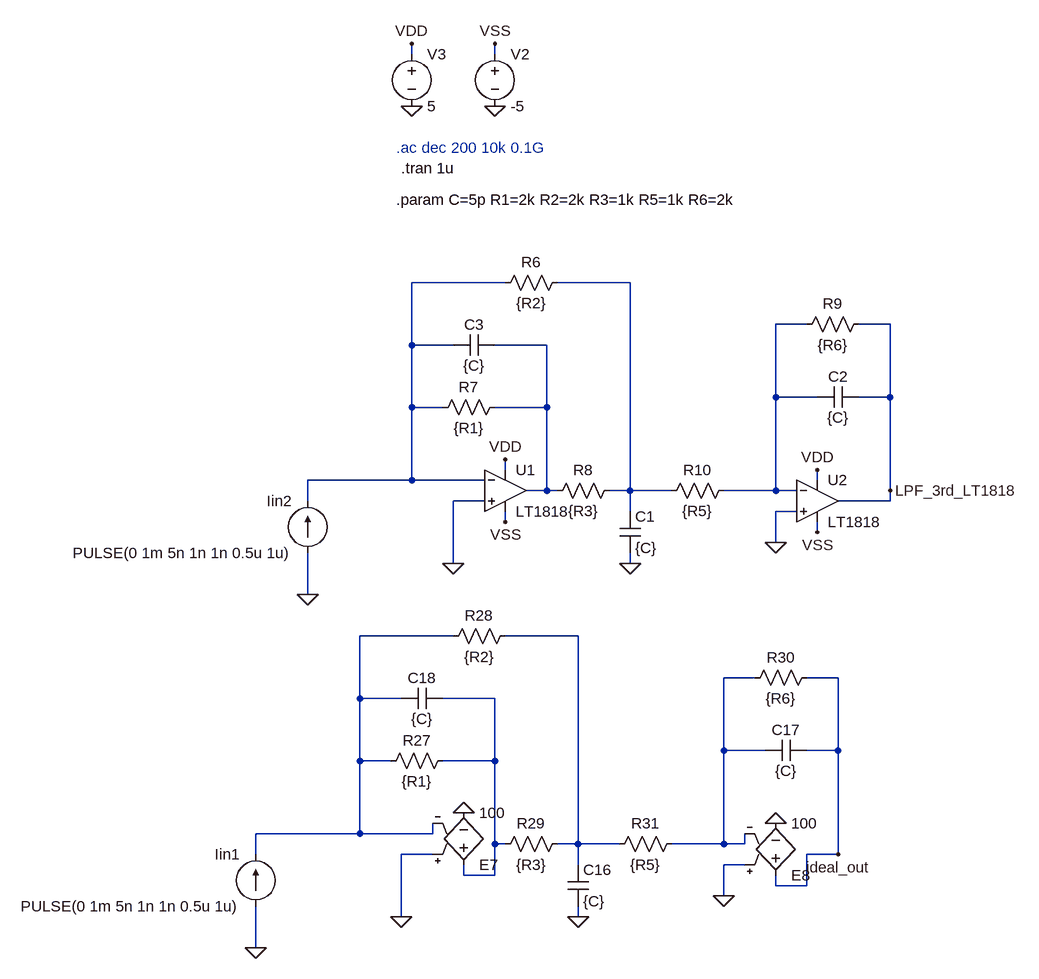
[diagram p0: schematic TIA-ALL_Z-LPF-TimeSim.asc]
TIA-ALL_Z-LPF-TimeSim.asc, the LTspice schematic file:
Version 4
SHEET 1 3536 3016
WIRE 496 608 496 592
WIRE 624 608 624 592
WIRE 640 960 496 960
WIRE 832 960 720 960
WIRE 1104 1024 1056 1024
WIRE 1232 1024 1184 1024
WIRE 496 1056 496 960
WIRE 560 1056 496 1056
WIRE 704 1056 624 1056
WIRE 1056 1136 1056 1024
WIRE 1120 1136 1056 1136
WIRE 1232 1136 1232 1024
WIRE 1232 1136 1184 1136
WIRE 496 1152 496 1056
WIRE 544 1152 496 1152
WIRE 704 1152 704 1056
WIRE 704 1152 624 1152
WIRE 640 1248 640 1232
WIRE 496 1264 496 1152
WIRE 496 1264 336 1264
WIRE 608 1264 496 1264
WIRE 1120 1264 1120 1248
WIRE 704 1280 704 1152
WIRE 704 1280 672 1280
WIRE 720 1280 704 1280
WIRE 832 1280 832 960
WIRE 832 1280 800 1280
WIRE 896 1280 832 1280
WIRE 1056 1280 1056 1136
WIRE 1056 1280 976 1280
WIRE 1088 1280 1056 1280
WIRE 1232 1280 1232 1136
WIRE 336 1296 336 1264
WIRE 608 1296 560 1296
WIRE 1232 1296 1232 1280
WIRE 1232 1296 1152 1296
WIRE 832 1312 832 1280
WIRE 1088 1312 1056 1312
WIRE 640 1328 640 1312
WIRE 1120 1344 1120 1328
WIRE 1056 1360 1056 1312
WIRE 560 1392 560 1296
WIRE 832 1392 832 1376
WIRE 336 1440 336 1376
WIRE 560 1504 416 1504
WIRE 752 1504 640 1504
WIRE 1024 1568 976 1568
WIRE 1152 1568 1104 1568
WIRE 416 1600 416 1504
WIRE 480 1600 416 1600
WIRE 624 1600 544 1600
WIRE 976 1680 976 1568
WIRE 1040 1680 976 1680
WIRE 1152 1680 1152 1568
WIRE 1152 1680 1104 1680
WIRE 416 1696 416 1600
WIRE 464 1696 416 1696
WIRE 624 1696 624 1600
WIRE 624 1696 544 1696
WIRE 416 1808 416 1696
WIRE 416 1808 256 1808
WIRE 528 1808 528 1792
WIRE 528 1808 416 1808
WIRE 624 1824 624 1696
WIRE 640 1824 624 1824
WIRE 752 1824 752 1504
WIRE 752 1824 720 1824
WIRE 816 1824 752 1824
WIRE 976 1824 976 1680
WIRE 976 1824 896 1824
WIRE 1008 1824 1008 1808
WIRE 1008 1824 976 1824
WIRE 256 1840 256 1808
WIRE 528 1840 480 1840
WIRE 1152 1840 1152 1680
WIRE 1152 1840 1104 1840
WIRE 752 1856 752 1824
WIRE 1008 1856 976 1856
WIRE 576 1872 576 1856
WIRE 624 1872 624 1824
WIRE 624 1872 576 1872
WIRE 1056 1888 1056 1872
WIRE 1104 1888 1104 1840
WIRE 1104 1888 1056 1888
WIRE 976 1904 976 1856
WIRE 480 1936 480 1840
WIRE 752 1936 752 1920
WIRE 256 1984 256 1920
FLAG 624 688 0
FLAG 496 688 0
FLAG 496 592 VDD
FLAG 624 592 VSS
FLAG 256 1984 0
FLAG 480 1936 0
FLAG 752 1936 0
FLAG 976 1904 0
FLAG 576 1776 0
FLAG 1056 1792 0
FLAG 1152 1840 ideal_out
FLAG 336 1440 0
FLAG 560 1392 0
FLAG 832 1392 0
FLAG 1056 1360 0
FLAG 1120 1248 VDD
FLAG 1120 1344 VSS
FLAG 640 1232 VDD
FLAG 640 1328 VSS
FLAG 1232 1280 LPF_3rd_LT1818
SYMBOL voltage 624 592 R0
WINDOW 123 0 0 Left 0
WINDOW 39 0 0 Left 0
SYMATTR InstName V2
SYMATTR Value -5
SYMBOL voltage 496 592 R0
WINDOW 123 0 0 Left 0
WINDOW 39 0 0 Left 0
SYMATTR InstName V3
SYMATTR Value 5
SYMBOL Res 560 1680 R90
WINDOW 0 0 56 VBottom 2
WINDOW 3 32 56 VTop 2
SYMATTR InstName R27
SYMATTR Value {R1}
SYMBOL Res 656 1488 R90
WINDOW 0 0 56 VBottom 2
WINDOW 3 32 56 VTop 2
SYMATTR InstName R28
SYMATTR Value {R2}
SYMBOL Res 736 1808 R90
WINDOW 0 0 56 VBottom 2
WINDOW 3 32 56 VTop 2
SYMATTR InstName R29
SYMATTR Value {R3}
SYMBOL Cap 736 1856 R0
SYMATTR InstName C16
SYMATTR Value {C}
SYMBOL e 576 1872 M180
SYMATTR InstName E7
SYMATTR Value 100
SYMBOL e 1056 1888 M180
SYMATTR InstName E8
SYMATTR Value 100
SYMBOL Res 1120 1552 R90
WINDOW 0 0 56 VBottom 2
WINDOW 3 32 56 VTop 2
SYMATTR InstName R30
SYMATTR Value {R6}
SYMBOL Cap 1104 1664 R90
WINDOW 0 0 32 VBottom 2
WINDOW 3 32 32 VTop 2
SYMATTR InstName C17
SYMATTR Value {C}
SYMBOL Res 912 1808 R90
WINDOW 0 0 56 VBottom 2
WINDOW 3 32 56 VTop 2
SYMATTR InstName R31
SYMATTR Value {R5}
SYMBOL Cap 544 1584 R90
WINDOW 0 0 32 VBottom 2
WINDOW 3 32 32 VTop 2
SYMATTR InstName C18
SYMATTR Value {C}
SYMBOL current 256 1920 R180
WINDOW 0 24 80 Left 2
WINDOW 3 24 0 Left 2
WINDOW 39 0 0 Left 0
SYMATTR InstName Iin1
SYMATTR Value PULSE(0 1m 5n 1n 1n 0.5u 1u)
SYMATTR Value2 AC 1m
SYMBOL OpAmps\\LT1818 640 1280 R0
SYMATTR InstName U1
SYMBOL current 336 1376 R180
WINDOW 0 24 80 Left 2
WINDOW 3 24 0 Left 2
WINDOW 39 0 0 Left 0
SYMATTR InstName Iin2
SYMATTR Value PULSE(0 1m 5n 1n 1n 0.5u 1u)
SYMATTR Value2 AC 1
SYMBOL Cap 816 1312 R0
SYMATTR InstName C1
SYMATTR Value {C}
SYMBOL Cap 1184 1120 R90
WINDOW 0 0 32 VBottom 2
WINDOW 3 32 32 VTop 2
SYMATTR InstName C2
SYMATTR Value {C}
SYMBOL Cap 624 1040 R90
WINDOW 0 0 32 VBottom 2
WINDOW 3 32 32 VTop 2
SYMATTR InstName C3
SYMATTR Value {C}
SYMBOL Res 736 944 R90
WINDOW 0 0 56 VBottom 2
WINDOW 3 32 56 VTop 2
SYMATTR InstName R6
SYMATTR Value {R2}
SYMBOL Res 640 1136 R90
WINDOW 0 0 56 VBottom 2
WINDOW 3 32 56 VTop 2
SYMATTR InstName R7
SYMATTR Value {R1}
SYMBOL Res 816 1264 R90
WINDOW 0 0 56 VBottom 2
WINDOW 3 32 56 VTop 2
SYMATTR InstName R8
SYMATTR Value {R3}
SYMBOL Res 1200 1008 R90
WINDOW 0 0 56 VBottom 2
WINDOW 3 32 56 VTop 2
SYMATTR InstName R9
SYMATTR Value {R6}
SYMBOL Res 992 1264 R90
WINDOW 0 0 56 VBottom 2
WINDOW 3 32 56 VTop 2
SYMATTR InstName R10
SYMATTR Value {R5}
SYMBOL OpAmps\\LT1818 1120 1296 R0
SYMATTR InstName U2
TEXT 472 752 Left 2 ;.ac dec 200 10k 0.1G
TEXT 472 832 Left 2 !.param C=5p R1=2k R2=2k R3=1k R5=1k R6=2k
TEXT 480 784 Left 2 !.tran 1u

The netlist it stands for:
* TIA-ALL_Z-LPF-TimeSim.asc
V2 VSS 0 -5
V3 VDD 0 5
R27 N008 N005 {R1}
R28 N006 N005 {R2}
R29 N006 N008 {R3}
C16 N006 0 {C}
E7 N008 0 0 N005 100
E8 ideal_out 0 0 N007 100
R30 ideal_out N007 {R6}
C17 ideal_out N007 {C}
R31 N007 N006 {R5}
C18 N008 N005 {C}
Iin1 0 N005 PULSE(0 1m 5n 1n 1n 0.5u 1u) AC 1m
XU1 0 N001 N004 VDD VSS LT1818  ; pins In+ In- OUT V+ V-
Iin2 0 N001 PULSE(0 1m 5n 1n 1n 0.5u 1u) AC 1
C1 N002 0 {C}
C2 LPF_3rd_LT1818 N003 {C}
C3 N004 N001 {C}
R6 N002 N001 {R2}
R7 N004 N001 {R1}
R8 N002 N004 {R3}
R9 LPF_3rd_LT1818 N003 {R6}
R10 N003 N002 {R5}
XU2 0 N003 LPF_3rd_LT1818 VDD VSS LT1818  ; pins In+ In- OUT V+ V-
* .ac dec 200 10k 0.1G
.param C=5p R1=2k R2=2k R3=1k R5=1k R6=2k
.tran 1u
.lib LTC2.lib
.backanno
.end